# EAGLE design 04.16.2016_02 (EAGLE 6.4)
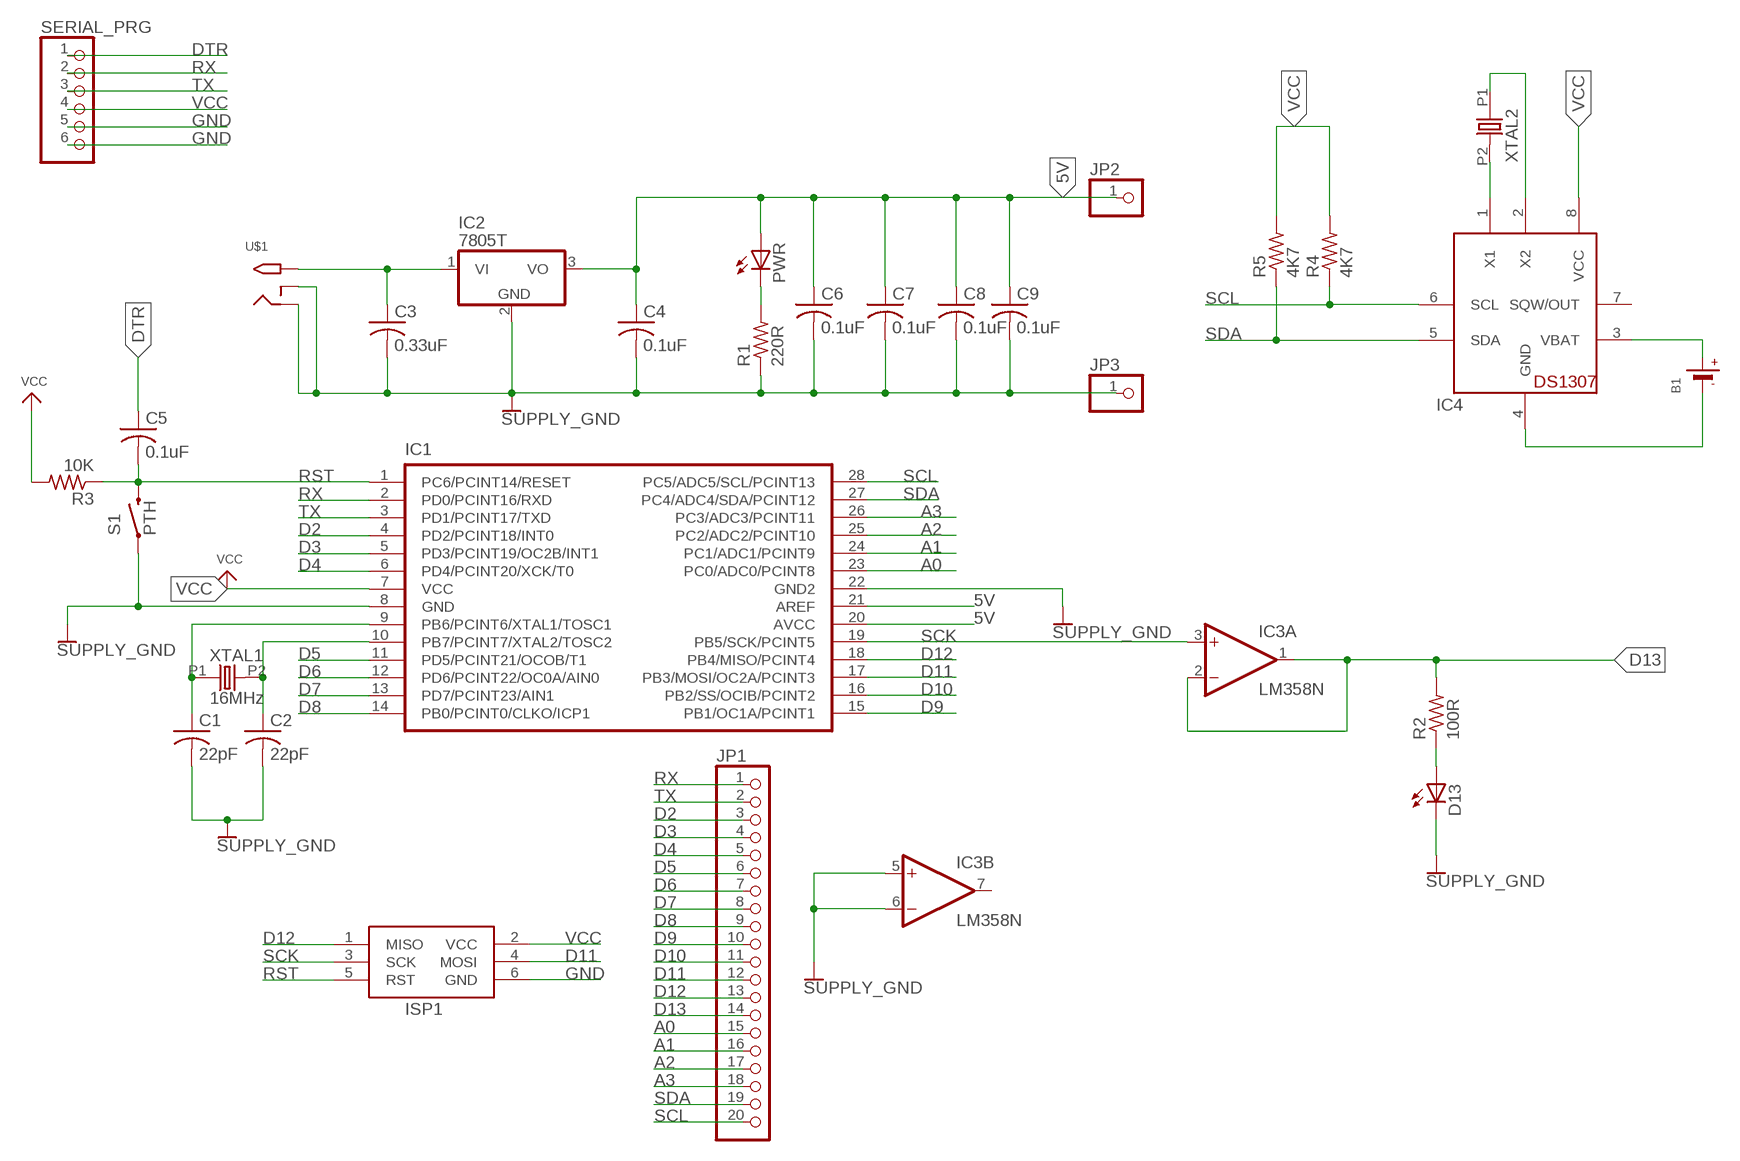
[diagram p0: schematic, sheet 1]

## Parts
B1  BATTERYCR2032  [CR2032]
C1  22pF  C-US050-025X075  [C050-025X075]
C2  22pF  C-US050-025X075  [C050-025X075]
C3  0.33uF  C-US050-025X075  [C050-025X075]
C4  0.1uF  C-US050-025X075  [C050-025X075]
C5  0.1uF  C-US050-025X075  [C050-025X075]
C6  0.1uF  C-US050-025X075  [C050-025X075]
C7  0.1uF  C-US050-025X075  [C050-025X075]
C8  0.1uF  C-US050-025X075  [C050-025X075]
C9  0.1uF  C-US050-025X075  [C050-025X075]
D13  LED5MM  [LED5MM]
IC1  IC_UC_ATMEGA328PDIL  [DIL28-N]
IC2  7805T  [TO220H]
IC3  LM358N  [DIL08]
IC4  DS1307  [DIL08]
ISP1  AVRISP-6  [AVRISP]
JP1  PINHD-1X20-BIG  [1X20-BIG]
JP2  PINHD-1X1  [1X01]
JP3  PINHD-1X1  [1X01]
PWR  LED5MM  [LED5MM]
R1  220R  R-US_0207/10  [0207/10]
R2  100R  R-US_0207/10  [0207/10]
R3  10K  R-US_0207/10  [0207/10]
R4  4K7  R-US_0207/10  [0207/10]
R5  4K7  R-US_0207/10  [0207/10]
S1  PTH  SWITCH-MOMENTARY-2PTH  [TACTILE-PTH]
SERIAL_PRG  PINHD-1X6  [1X06]
U$1  2.1MMJACKTHM  [PJ-102A]
XTAL1  16MHz  OSC-XTAL-HC-49U-PTH  [HC-49U-PTH]
XTAL2  OSC-XTALTC-26  [TC-26]

## Nets
5V: C4.1 C6.1 C7.1 C8.1 C9.1 IC1.20(AVCC) IC1.21(AREF) IC2.3(VO) JP2.1 PWR.A
A0: IC1.23(PC0/ADC0/PCINT8) JP1.15
A1: IC1.24(PC1/ADC1/PCINT9) JP1.16
A2: IC1.25(PC2/ADC2/PCINT10) JP1.17
A3: IC1.26(PC3/ADC3/PCINT11) JP1.18
D2: IC1.4(PD2/PCINT18/INT0) JP1.3
D3: IC1.5(PD3/PCINT19/OC2B/INT1) JP1.4
D4: IC1.6(PD4/PCINT20/XCK/T0) JP1.5
D5: IC1.11(PD5/PCINT21/OCOB/T1) JP1.6
D6: IC1.12(PD6/PCINT22/OC0A/AIN0) JP1.7
D7: IC1.13(PD7/PCINT23/AIN1) JP1.8
D8: IC1.14(PB0/PCINT0/CLKO/ICP1) JP1.9
D9: IC1.15(PB1/OC1A/PCINT1) JP1.10
D10: IC1.16(PB2/SS/OCIB/PCINT2) JP1.11
D11: IC1.17(PB3/MOSI/OC2A/PCINT3) ISP1.4(MOSI) JP1.12
D12: IC1.18(PB4/MISO/PCINT4) ISP1.1(MISO) JP1.13
D13: IC3.1(A:OUT) IC3.2(A:-IN) JP1.14 R2.2
DTR: C5.1 SERIAL_PRG.1
GND: C1.2 C2.2 C3.2 C4.2 C6.2 C7.2 C8.2 C9.2 D13.K(C) IC1.8(GND) IC1.22(GND2) IC2.2(GND) IC3.5(B:+IN) IC3.6(B:-IN) ISP1.6(GND) JP3.1 R1.1 S1.1 SERIAL_PRG.5 SERIAL_PRG.6 U$1.RING U$1.RING_SW ; supply symbol labelled SUPPLY_GND
N$1: C1.1 IC1.9(PB6/PCINT6/XTAL1/TOSC1) XTAL1.P1
N$2: C2.1 IC1.10(PB7/PCINT7/XTAL2/TOSC2) XTAL1.P2
N$3: PWR.K(C) R1.2
N$4: D13.A R2.1
N$5: C3.1 IC2.1(VI) U$1.TIP
N$6: IC4.1(X1) XTAL2.P2
N$9: IC4.2(X2) XTAL2.P1
N$10: B1.- IC4.4(GND)
N$11: B1.+ IC4.3(VBAT)
RST: C5.2 IC1.1(PC6/PCINT14/RESET) ISP1.5(RST) R3.1 S1.3
RX: IC1.2(PD0/PCINT16/RXD) JP1.1 SERIAL_PRG.2
SCK: IC1.19(PB5/SCK/PCINT5) IC3.3(A:+IN) ISP1.3(SCK)
SCL: IC1.28(PC5/ADC5/SCL/PCINT13) IC4.6(SCL) JP1.20 R4.1
SDA: IC1.27(PC4/ADC4/SDA/PCINT12) IC4.5(SDA) JP1.19 R5.1
TX: IC1.3(PD1/PCINT17/TXD) JP1.2 SERIAL_PRG.3
VCC: IC1.7(VCC) IC4.8(VCC) ISP1.2(VCC) R3.2 R4.2 R5.2 SERIAL_PRG.4
Unconnected: IC3.7(B:OUT) IC4.7(SQW/OUT)

## Power pins joined to a net without a drawn wire
V+: IC3.8(P:V+)
V-: IC3.4(P:V-)

## Library data of the parts
B1 = microbuilder:BATTERY: CR1220 SMT - Digikey: 3001K-ND
C1-C9 = adafruit:C-US: CAPACITOR, American symbol
D13 PWR = adafruit:LED: LED OSRAM: - CHIPLED LG R971, LG N971, LY N971, LG Q971, LY Q971, LO R971, LY R971 LH N974, LH R974 LS Q976, LO Q976, LY Q976 LO Q996 - Hyper CHIPLED LW Q18S LB Q993, LB Q99A, LB R99A - SideLED LS A670, LO A670, LY A670, LG A670, LP A670 LB A673, LV A673, LT A673, LW A673 LH A674 LY A675 LS A676, LA A676, LO A676, LY A676, LW A676 LS A679, LY A679, LG A679 - Hyper Micro SIDELED® LS Y876, LA Y876, LO Y876, LY Y876 LT Y87S - SmartLED LW L88C, LW L88S LB L89C, LB L89S, LG L890 LS L89K, LO L89K, LY L89K LS L896, LA L896, LO L896, LY L896 - TOPLED LS T670, LO T670, LY T670, LG T670, LP T670 LSG T670, LSP T670, LSY T670, LOP T670, LYG T670 LG T671, LOG T671, LSG T671 LB T673, LV T673, LT T673, LW T673 LH T674 LS T676, LA T676, LO T676, LY T676, LB T676, LH T676, LSB T676, LW T676 LB T67C, LV T67C, LT T67C, LS T67K, LO T67K, LY T67K, LW E67C LS E67B, LA E67B, LO E67B, LY E67B, LB E67C, LV E67C, LT E67C LW T67C LS T679, LY T679, LG T679 LS T770, LO T770, LY T770, LG T770, LP T770 LB T773, LV T773, LT T773, LW T773 LH T774 LS E675, LA E675, LY E675, LS T675 LS T776, LA T776, LO T776, LY T776, LB T776 LHGB T686 LT T68C, LB T68C - Hyper Mini TOPLED® LB M676 - Mini TOPLED Santana® LG M470 LS M47K, LO M47K, LY M47K Source: http://www.osram.convergy.de/
IC1 = dp_devices:IC_UC_ATMEGA328P
IC2 = adafruit:78*: Positive VOLTAGE REGULATOR Added bigger pads to the TO-92 package
IC3 = linear:LM358: OP AMP also LM158; LM258; LM2904 Source: http://cache.national.com/ds/LM/LM158.pdf
IC4 = adafruit:DS1307: DS1307 Real time clock (RTC) with battery backup ability. Talk to it via i2c
ISP1 = adafruit:AVRISP: AVR ISP HEADER Standard 6 pin header for AVR programming
JP1 = adafruit:PINHD-1X20: PIN HEADER
JP2 JP3 = adafruit:PINHD-1X1: Pin header 1x1 for 0.1" spacing With round pins
R1-R5 = adafruit:R-US_: RESISTOR, American symbol
S1 = SparkFun-Electromechanical:SWITCH-MOMENTARY-2: Various NO switches- pushbuttons, reed, etc; PROD_ID: SWCH-08441
SERIAL_PRG = adafruit:PINHD-1X6: PIN HEADER
U$1 = adafruit:2.1MMJACK: 2.1mm x 5.5mm THM DC jack with internal switch. Digikey part #PJ-102A, 4UCON part #05537 2.1mm x 5.5mm SMT DC jack with internal switch. Digikey part #PJ-002A-SMT, 4UCON part #03267 By microbuilder.eu & adafruit.com
XTAL1 XTAL2 = dp_devices:OSC-XTAL

## Board
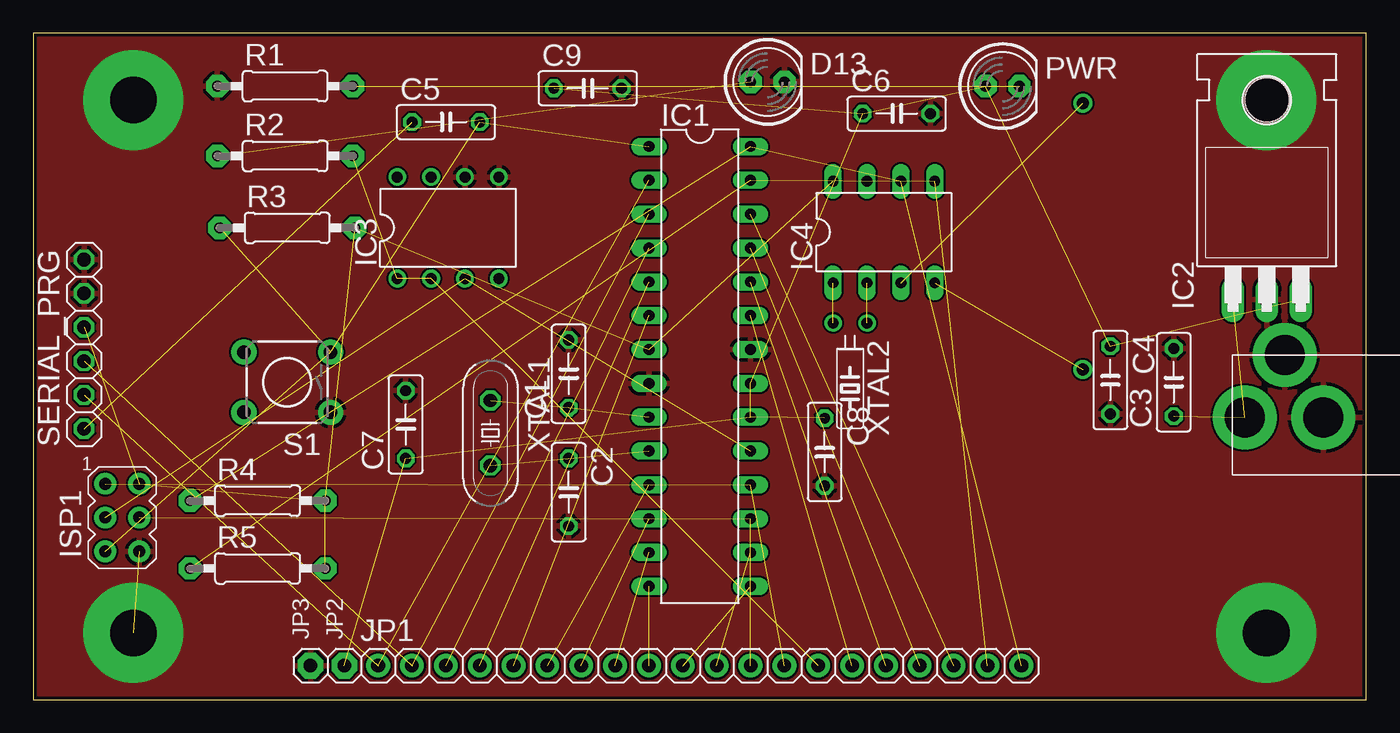
[diagram p1: board, top side]
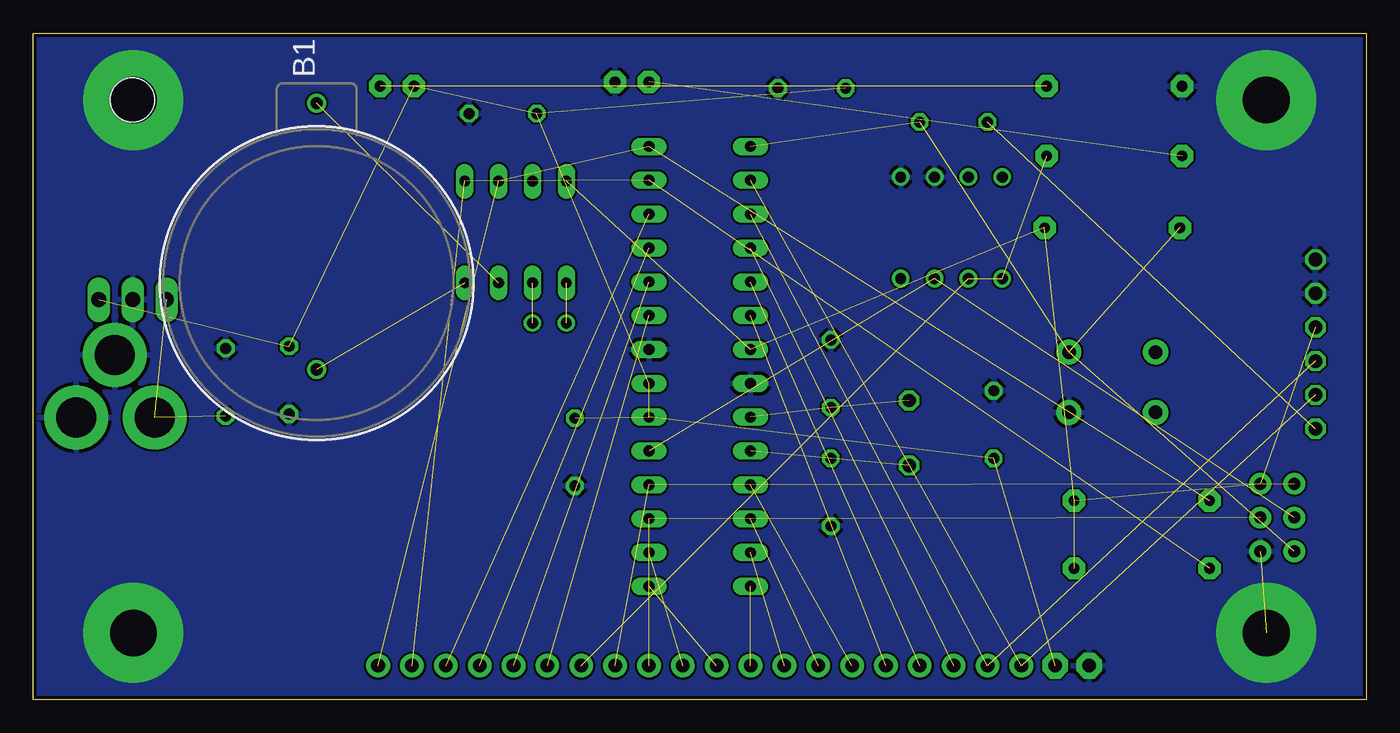
[diagram p2: board, bottom side, seen from below]

Size 100 x 50 mm. Coordinates in mm from the lower left corner, seen from the top.
Outline: 0,0 100,0 100,50 0,50 0,0
Copper layers (1*16): Top 0.035mm / dielectric 1.5mm / Bottom 0.035mm
Design rules "SeeedStudio_2layer_DRU_no_angle_20140221": minimum track width 6mil, minimum drill 12mil, track to track 6mil, track to pad 6mil, pad to pad 6mil, via to via 6mil, smd to smd 0mil, copper to edge 10mil, drill to drill 10mil, minimum pad ring 10mil, minimum via ring 6mil, stop-mask expansion 2mil, vias tented up to drill 100mil, thermal gap 10mil

### Footprints (pad centres in the part's own frame; a part is rotated, then mirrored left to right if it is on the bottom)
CR2032 = drill 0.9: + 10,0; - -10,0
C050-025X075 = drill 0.813 octagon: 1 -2.54,0; 2 2.54,0
LED5MM = drill 0.813 pad 1.676 octagon: A -1.27,0; K 1.27,0
DIL28-N = drill 0.813 long: 1 -16.51,-3.81; 2 -13.97,-3.81; 3 -11.43,-3.81; 4 -8.89,-3.81; 5 -6.35,-3.81; 6 -3.81,-3.81; 7 -1.27,-3.81; 8 1.27,-3.81; 9 3.81,-3.81; 10 6.35,-3.81; 11 8.89,-3.81; 12 11.43,-3.81; 13 13.97,-3.81; 14 16.51,-3.81; 15 16.51,3.81; 16 13.97,3.81; 17 11.43,3.81; 18 8.89,3.81; 19 6.35,3.81; 20 3.81,3.81; 21 1.27,3.81; 22 -1.27,3.81; 23 -3.81,3.81; 24 -6.35,3.81; 25 -8.89,3.81; 26 -11.43,3.81; 27 -13.97,3.81; 28 -16.51,3.81
TO220H = drill 1.118 long: 1 -2.54,-10.16; 2 0,-10.16; 3 2.54,-10.16 | hole 3.302: 0,4.826
DIL08 = drill 0.813 pad 1.27: 1 -3.81,-3.81; 2 -1.27,-3.81; 3 1.27,-3.81; 4 3.81,-3.81; 5 3.81,3.81; 6 1.27,3.81; 7 -1.27,3.81; 8 -3.81,3.81
DIL08' = drill 0.813 long: 1 -3.81,-3.81; 2 -1.27,-3.81; 3 1.27,-3.81; 4 3.81,-3.81; 5 3.81,3.81; 6 1.27,3.81; 7 -1.27,3.81; 8 -3.81,3.81
AVRISP = drill 0.9 pad 1.626: 1 -1.27,2.54; 2 1.27,2.54; 3 -1.27,0; 4 1.27,0; 5 -1.27,-2.54; 6 1.27,-2.54
1X20-BIG = drill 1.016 pad 1.778: 1 -24.13,0; 2 -21.59,0; 3 -19.05,0; 4 -16.51,0; 5 -13.97,0; 6 -11.43,0; 7 -8.89,0; 8 -6.35,0; 9 -3.81,0; 10 -1.27,0; 11 1.27,0; 12 3.81,0; 13 6.35,0; 14 8.89,0; 15 11.43,0; 16 13.97,0; 17 16.51,0; 18 19.05,0; 19 21.59,0; 20 24.13,0
1X01 = drill 1.016 pad 1.93 octagon: 1 0,0
0207/10 = drill 0.813 pad 1.676 octagon: 1 -5.08,0; 2 5.08,0
TACTILE-PTH = drill 1.016 pad 1.88: 1 -3.251,2.261; 2 3.251,2.261; 3 -3.251,-2.261; 4 3.251,-2.261
1X06 = drill 1.016 octagon: 1 -6.35,0; 2 -3.81,0; 3 -1.27,0; 4 1.27,0; 5 3.81,0; 6 6.35,0
PJ-102A = drill 3 pad 4.8: RING 0.1,-3.39; RING_SW -4.6,-6.29; TIP 0.1,-9.29
HC-49U-PTH = drill 1 octagon: P1 -2.44,0; P2 2.44,0
TC-26 = drill 0.8: P1 -1.27,-2.54; P2 1.27,-2.54

### Placement (x,y rotation side)
B1  78.74,34.77 90 bottom
C1  40.16,24.45 90 top
C2  40.16,15.56 270 top
C3  85.57,23.81 90 top
C4  80.8,23.97 270 top
C5  30.96,43.34 0 top
C6  64.77,43.97 0 top
C7  27.94,20.64 90 top
C8  59.37,18.57 270 top
C9  41.59,45.88 0 top
D13  55.09,46.35 0 top
IC1  50,25 270 top
IC2  92.55,40.16 0 top
IC3  31.11,35.4 0 top
IC4  DS1307  [DIL08']  63.82,35.08 0 top
ISP1  6.67,13.65 0 top
JP1  50,2.54 0 top
JP2  23.34,2.54 0 top
JP3  20.8,2.54 0 top
PWR  72.71,46.04 0 top
R1  18.89,46.04 0 top
R2  18.89,40.8 0 top
R3  19.05,35.4 0 top
R4  16.83,14.92 0 top
R5  16.83,9.84 0 top
S1  19.05,23.81 180 top
SERIAL_PRG  3.81,26.67 90 top
U$1  100.17,21.27 270 top
XTAL1  34.29,20 270 top
XTAL2  61.28,25.72 180 top

### Tracks (layer width: path | path; a pad name or v marks a point on that pad's centre or on a via)
5V  (9 unrouted)
A0  (1 unrouted)
A1  (1 unrouted)
A2  (1 unrouted)
A3  (1 unrouted)
D2  (1 unrouted)
D3  (1 unrouted)
D4  (1 unrouted)
D5  (1 unrouted)
D6  (1 unrouted)
D7  (1 unrouted)
D8  (1 unrouted)
D9  (1 unrouted)
D10  (1 unrouted)
D11  (2 unrouted)
D12  (2 unrouted)
D13  (3 unrouted)
DTR  (1 unrouted)
GND  (via drill 3.5 pad 7.5)  (1 unrouted)
  other vias: 7.5,45 92.5,45 92.5,5 7.5,5
  pour Top: 0,0 100.01,0 100.01,50.01 0,50.01
  pour Bottom: 0,0 100.01,0 100.01,50.01 0,50.01
N$1  (2 unrouted)
N$2  (2 unrouted)
N$3  (1 unrouted)
N$4  (1 unrouted)
N$5  (2 unrouted)
N$6  (1 unrouted)
N$9  (1 unrouted)
N$10  (1 unrouted)
N$11  (1 unrouted)
RST  (4 unrouted)
RX  (2 unrouted)
SCK  (2 unrouted)
SCL  (3 unrouted)
SDA  (3 unrouted)
TX  (2 unrouted)
VCC  (6 unrouted)